# EAGLE design Lego PowerFunctions I2C Board (EAGLE 7.2.0)
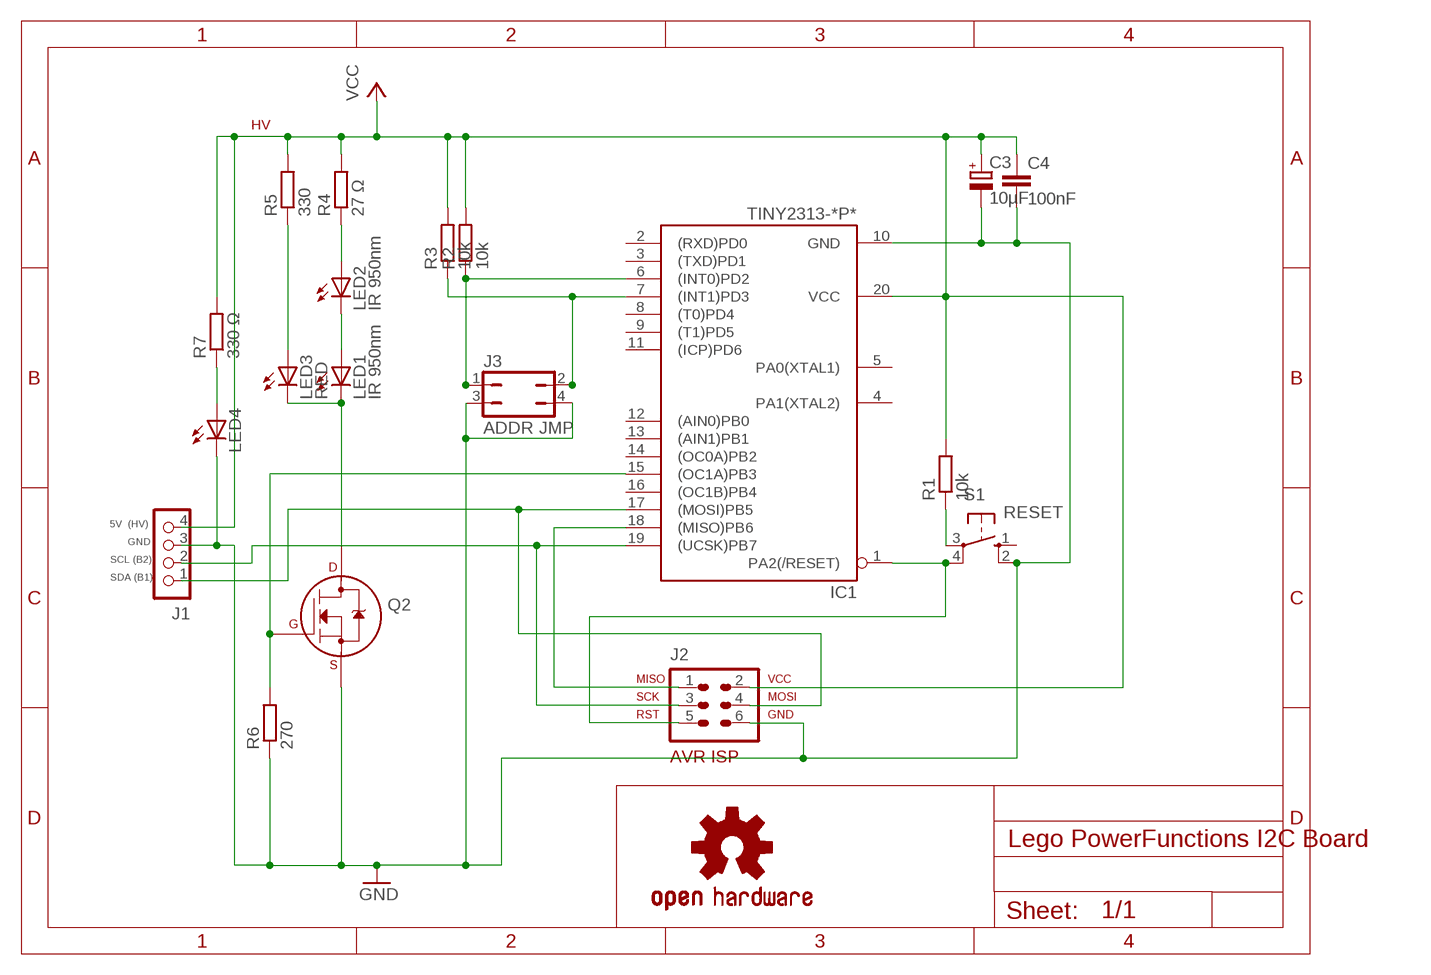
[diagram p0: schematic, sheet 1]

## Parts
C3  10µF  CPOL-EUE2.5-6  [E2,5-6]
C4  100nF  C-EU025-025X050  [C025-025X050]
IC1  TINY2313-*P*  [DIL20]
J1  CON_HEADER_1X04  [M1X4]
J2  AVR-ISP-6VERT  [AVR-ISP-6]
J3  ADDR JMP  JP2Q  [JP2Q]
LED1  IR 950nm  LED5MM  [LED5MM]
LED2  IR 950nm  LED5MM  [LED5MM]
LED3  RED  LED3MM  [LED3MM]
LED4  LED3MM  [LED3MM]
LOGO1  OSHW-LOGOM  [OSHW-LOGO-M]
Q2  2N7000_TO92  [TO-92]
R1  10k  R-EU_0207/10  [0207/10]
R2  10k  R-EU_0207/10  [0207/10]
R3  10k  R-EU_0207/10  [0207/10]
R4  27 Ω  R-EU_0207/10  [0207/10]
R5  330  R-EU_0207/10  [0207/10]
R6  270  R-EU_0207/10  [0207/10]
R7  330 Ω  R-EU_0207/10  [0207/10]
S1  RESET  10-XX  [B3F-10XX]

## Nets
GND: C3.- C4.2 IC1.10(GND) J1.3 J2.6 J3.3 J3.4 LED4.K(C) Q2.1(S) R6.1 S1.2(S1)
I2CADDRH: IC1.7((INT1)PD3) J3.2 R3.1
I2CADDRL: IC1.6((INT0)PD2) J3.1 R2.1
MISO: IC1.18((MISO)PB6) J2.1
MOSI: IC1.17((MOSI)PB5) J1.1 J2.4
N$2: LED4.A R7.1
N$9: R1.1 S1.3(P)
N$12: LED2.A R4.1
N$13: LED3.A R5.1
N$14: LED1.A LED2.K(C)
N$15: LED1.K(C) LED3.K(C) Q2.3(D)
N$17: IC1.15((OC1A)PB3) Q2.2(G) R6.2
RST: IC1.1(PA2(/RESET)) J2.5 S1.4(P1)
SCL: IC1.19((UCSK)PB7) J1.2 J2.3
VCC: C3.+ C4.1 IC1.20(VCC) J1.4 J2.2 R1.2 R2.2 R3.2 R4.2 R5.2 R7.2
Unconnected: IC1.2((RXD)PD0) IC1.3((TXD)PD1) IC1.4(PA1(XTAL2)) IC1.5(PA0(XTAL1)) IC1.8((T0)PD4) IC1.9((T1)PD5) IC1.11((ICP)PD6) IC1.12((AIN0)PB0) IC1.13((AIN1)PB1) IC1.14((OC0A)PB2) IC1.16((OC1B)PB4) S1.1(S)

## Notes on the sheet
- HV
- 5V  (HV)
- GND
- SCL (B2)
- SDA (B1)

## Library data of the parts
C3 = rcl:CPOL-EU: POLARIZED CAPACITOR, European symbol
C4 = rcl:C-EU: CAPACITOR, European symbol
IC1 = avr-7:TINY2313*: Atmel Tiny2313 2K Flash, 128 bytes EEPROM, 128 bytes RAM
J1 = dp_devices:CON_HEADER_1X04
J2 = avr-7:AVR-ISP-6: AVR ISP-6 Serial Programming Header
J3 = jumper:JP2Q: JUMPER
LED1-LED4 = led:LED: LED OSRAM: - CHIPLED LG R971, LG N971, LY N971, LG Q971, LY Q971, LO R971, LY R971 LH N974, LH R974 LS Q976, LO Q976, LY Q976 LO Q996 - Hyper CHIPLED LW Q18S LB Q993, LB Q99A, LB R99A - SideLED LS A670, LO A670, LY A670, LG A670, LP A670 LB A673, LV A673, LT A673, LW A673 LH A674 LY A675 LS A676, LA A676, LO A676, LY A676, LW A676 LS A679, LY A679, LG A679 - Hyper Micro SIDELED® LS Y876, LA Y876, LO Y876, LY Y876 LT Y87S - SmartLED LW L88C, LW L88S LB L89C, LB L89S, LG L890 LS L89K, LO L89K, LY L89K LS L896, LA L896, LO L896, LY L896 - TOPLED LS T670, LO T670, LY T670, LG T670, LP T670 LSG T670, LSP T670, LSY T670, LOP T670, LYG T670 LG T671, LOG T671, LSG T671 LB T673, LV T673, LT T673, LW T673 LH T674 LS T676, LA T676, LO T676, LY T676, LB T676, LH T676, LSB T676, LW T676 LB T67C, LV T67C, LT T67C, LS T67K, LO T67K, LY T67K, LW E67C LS E67B, LA E67B, LO E67B, LY E67B, LB E67C, LV E67C, LT E67C LW T67C LS T679, LY T679, LG T679 LS T770, LO T770, LY T770, LG T770, LP T770 LB T773, LV T773, LT T773, LW T773 LH T774 LS E675, LA E675, LY E675, LS T675 LS T776, LA T776, LO T776, LY T776, LB T776 LHGB T686 LT T68C, LB T68C - Hyper Mini TOPLED® LB M676 - Mini TOPLED Santana® LG M470 LS M47K, LO M47K, LY M47K Source: http://www.osram.convergy.de LUXEON: - LUMILED® LXK2-PW12-R00, LXK2-PW12-S00, LXK2-PW14-U00, LXK2-PW14-V00 LXK2-PM12-R00, LXK2-PM12-S00, LXK2-PM14-U00 LXK2-PE12-Q00, LXK2-PE12-R00, LXK2-PE12-S00, LXK2-PE14-T00, LXK2-PE14-U00 LXK2-PB12-K00, LXK2-PB12-L00, LXK2-PB12-M00, LXK2-PB14-N00, LXK2-PB14-P00, LXK2-PB14-Q00 LXK2-PR12-L00, LXK2-PR12-M00, LXK2-PR14-Q00, LXK2-PR14-R00 LXK2-PD12-Q00, LXK2-PD12-R00, LXK2-PD12-S00 LXK2-PH12-R00, LXK2-PH12-S00 LXK2-PL12-P00, LXK2-PL12-Q00, LXK2-PL12-R00 Source: www.luxeon.com KINGBRIGHT: KA-3528ASYC Source: www.kingbright.com
LOGO1 = SparkFun-Aesthetics:OSHW-LOGO: Open Source Hardware Logo This logo indicates the piece of hardware it is found on incorporates a OSHW license and/or adheres to the definition of open source hardware found here: http://freedomdefined.org/OSHW
Q2 = transistors:2N700*: 2N7000, 2N7002, NDS7002A N-channel enhancement mode MOSFET
R1-R7 = rcl:R-EU_: RESISTOR, European symbol
S1 = switch-omron:10-XX: OMRON SWITCH; MPN: B3F-1000; OC_FARNELL: 176432; OC_NEWARK: 36M3542

## Net classes
0 default: drill 0.61 mm

## Board
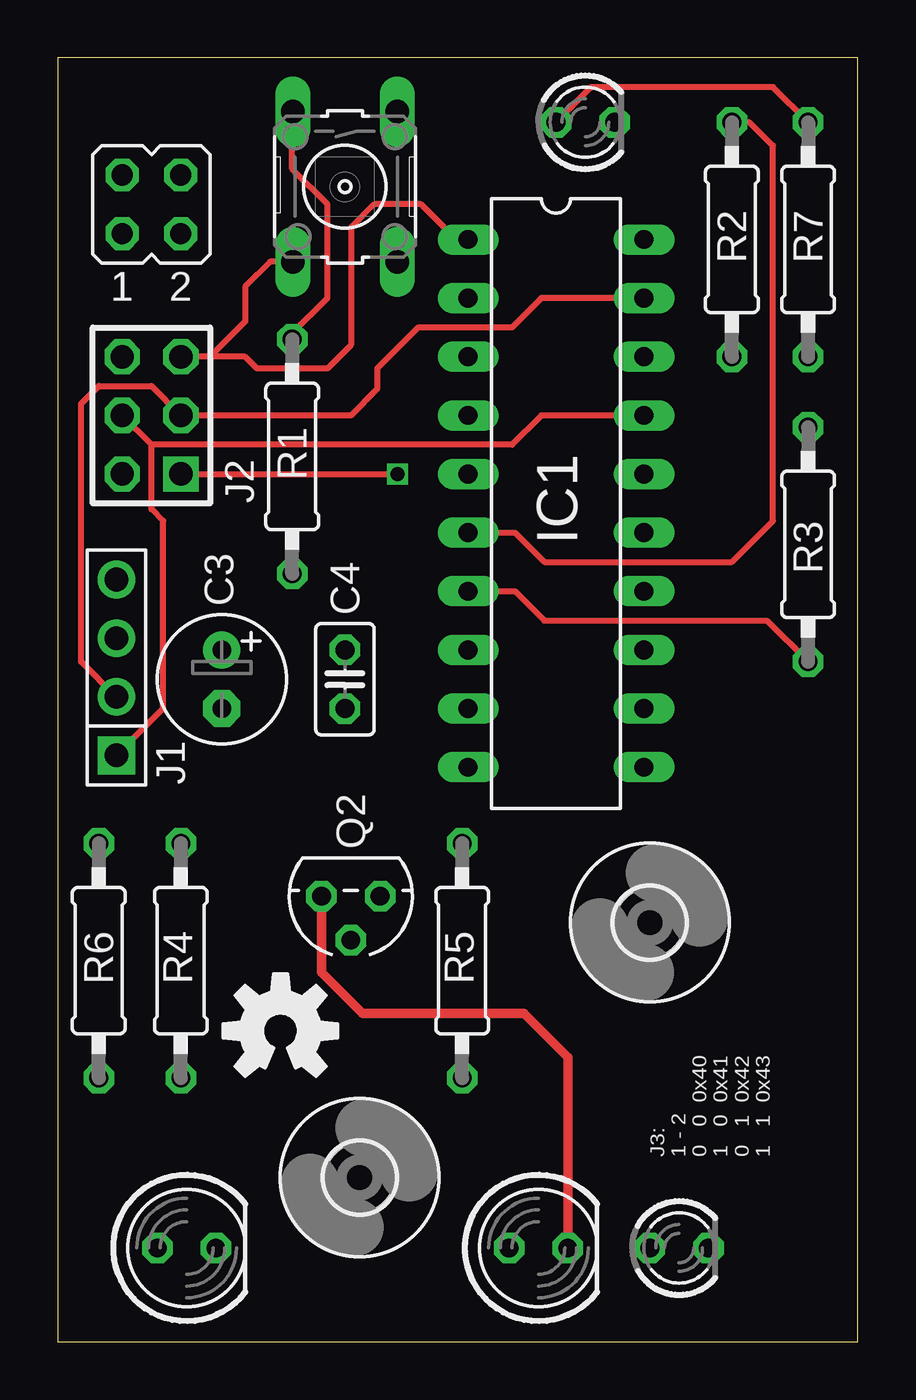
[diagram p1: board, top side]
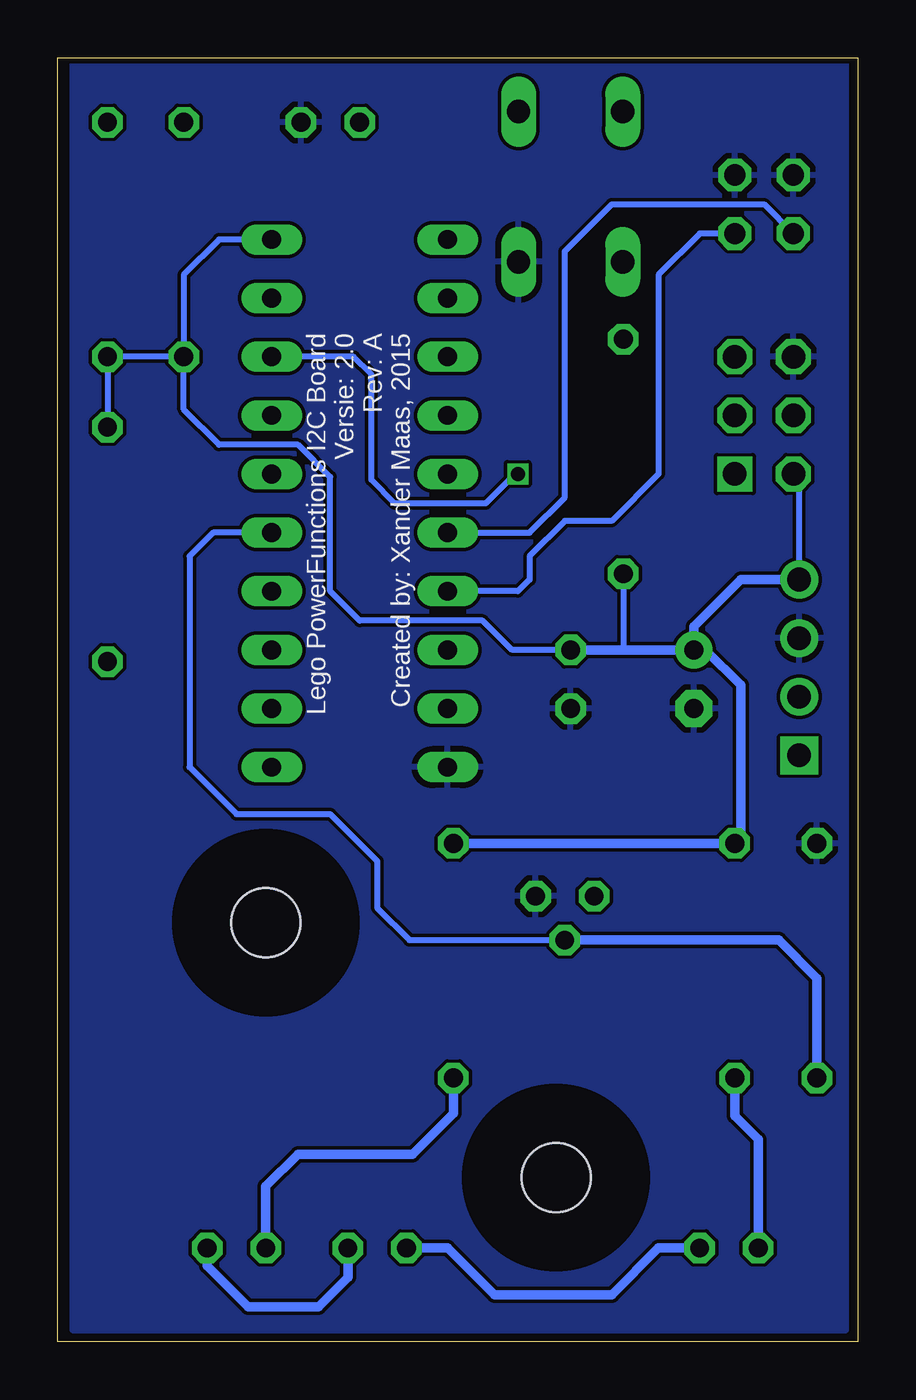
[diagram p2: board, bottom side, seen from below]

Size 34.67 x 55.63 mm. Coordinates in mm from the lower left corner, seen from the top.
Outline: 0,0 34.67,0 34.67,55.63 0,55.63 0,0
Copper layers (1*16): Top 0.035mm / dielectric 1.5mm / Bottom 0.035mm
Design rules "SeeedStudio_2layer_DRU_no_angle_20140221": minimum track width 6mil, minimum drill 12mil, track to track 6mil, track to pad 6mil, pad to pad 6mil, via to via 6mil, smd to smd 0mil, copper to edge 10mil, drill to drill 10mil, minimum pad ring 10mil, minimum via ring 6mil, stop-mask expansion 2mil, vias tented up to drill 100mil, thermal gap 10mil

### Footprints (pad centres in the part's own frame; a part is rotated, then mirrored left to right if it is on the bottom)
E2,5-6 = drill 0.813 pad 1.6: + -1.27,0 | drill 0.813 pad 1.6 octagon: - 1.27,0
C025-025X050 = drill 0.813 octagon: 1 -1.27,0; 2 1.27,0
DIL20 = drill 0.813 long: 1 -11.43,-3.81; 2 -8.89,-3.81; 3 -6.35,-3.81; 4 -3.81,-3.81; 5 -1.27,-3.81; 6 1.27,-3.81; 7 3.81,-3.81; 8 6.35,-3.81; 9 8.89,-3.81; 10 11.43,-3.81; 11 11.43,3.81; 12 8.89,3.81; 13 6.35,3.81; 14 3.81,3.81; 15 1.27,3.81; 16 -1.27,3.81; 17 -3.81,3.81; 18 -6.35,3.81; 19 -8.89,3.81; 20 -11.43,3.81
M1X4 = drill 1.02 pad 1.632 square: 1 0,0 | drill 1.02 pad 1.632: 2 2.54,0; 3 5.08,0; 4 7.62,0
AVR-ISP-6 = drill 1.016 square: 1 -2.54,-1.27 | drill 1.016 octagon: 2 -2.54,1.27; 3 0,-1.27; 4 0,1.27; 5 2.54,-1.27; 6 2.54,1.27
JP2Q = drill 0.914 octagon: 1 -1.27,-1.27; 2 1.27,-1.27; 3 -1.27,1.27; 4 1.27,1.27
LED5MM = drill 0.813 octagon: A -1.27,0; K 1.27,0
LED3MM = drill 0.813 octagon: A -1.27,0; K 1.27,0
TO-92 = drill 0.813 octagon: 1 -1.27,0; 2 0,1.905; 3 1.27,0
0207/10 = drill 0.813 octagon: 1 -5.08,0; 2 5.08,0
B3F-10XX = drill 1.016 long: 1 -3.251,2.261; 2 3.251,2.261; 3 -3.251,-2.261; 4 3.251,-2.261
3,0 = hole 3: 0,0

### Placement (x,y rotation side)
C3  7.11,28.7 270 top
C4  12.45,28.7 270 top
IC1  21.59,36.32 270 top
J1  2.54,25.4 90 top
J2  4.06,40.13 90 top
J3  4.06,49.28 0 top
LED1  20.83,4.06 0 top
LED2  5.59,4.06 0 top
LED3  26.92,4.06 0 top
LED4  22.86,52.83 0 top
LOGO1  9.65,13.46 0 top
Q2  12.7,19.3 180 top
R1  10.16,38.35 270 top
R2  29.21,47.75 270 top
R3  32.51,34.54 90 top
R4  5.33,16.51 90 top
R5  17.53,16.51 90 top
R6  1.78,16.51 270 top
R7  32.51,47.75 270 top
S1  12.45,50.04 270 top
U$1  [3,0]  13.08,7.11 0 top
U$2  [3,0]  25.65,18.16 0 top

### Tracks (layer width: path | path; a pad name or v marks a point on that pad's centre or on a via)
GND
  pour Bottom: 0.51,55.37 34.04,55.37 34.04,0.51 0.51,0.51
I2CADDRH
  Top 0.254: IC1.7 19.81,32.51 21.08,31.24 30.73,31.24 R3.1
  Bottom 0.254: J3.2 6.86,48.01 8.64,46.23 8.64,37.59 10.67,35.56 12.7,35.56 14.22,34.04 14.22,33.02 14.73,32.51 IC1.7
I2CADDRL
  Top 0.254: IC1.6 19.81,35.05 21.08,33.78 29.21,33.78 30.99,35.56 30.99,51.82 29.97,52.83 R2.1
  Bottom 0.254: IC1.6 14.22,35.05 12.7,36.58 12.7,47.24 10.67,49.28 4.06,49.28 J3.1
MISO  (via drill 0.61)
  Top 0.254: J2.1 v14.73,37.59
  Bottom 0.254: v14.73,37.59 14.86,37.59 16.13,36.32 20.07,36.32 21.08,37.34 21.08,41.91 21.84,42.67 IC1.18
MOSI
  Top 0.254: IC1.17 20.95,40.13 19.68,38.86 4.06,38.86 | 4.06,38.86 J2.4 | J1.1 4.57,27.43 4.57,35.56 4.06,36.07 4.06,38.86
N$2
  Top 0.254: R7.1 30.99,54.36 23.11,54.36 LED4.A
N$9
  Top 0.254: R1.1 10.16,43.69 11.68,45.21 11.68,49.28 10.16,50.8 10.16,53.26
  Top 0.305: 10.16,53.26 S1.3
N$12
  Bottom 0.406: LED2.A 4.32,8.76 5.33,9.78 R4.1
N$13
  Bottom 0.406: R5.1 17.53,9.91 19.3,8.13 24.26,8.13 25.65,6.73 LED3.A
N$14
  Bottom 0.406: LED1.A 17.78,4.06 15.75,2.03 10.67,2.03 8.64,4.06 LED2.K
N$15
  Top 0.406: Q2.3 11.43,16 13.21,14.22 20.19,14.22 22.1,12.32 LED1.K
  Bottom 0.406: LED3.K 28.19,3.3 26.42,1.52 23.37,1.52 22.1,2.79 LED1.K
N$17
  Bottom 0.254: IC1.15 27.94,35.05 28.96,34.04 28.96,24.89 26.92,22.86 22.86,22.86 20.83,20.83 20.83,18.8 19.43,17.4 Q2.2
  Bottom 0.406: Q2.2 3.43,17.4 1.78,15.75 R6.2
RST
  Top 0.254: IC1.1 17.27,47.75 15.75,49.28 13.72,49.28 12.7,48.26 12.7,43.18 11.68,42.16 8.64,42.16 8.13,42.67 6.6,42.67 | 6.6,42.67 J2.5 | S1.4 9.2,46.79 8.13,45.72 8.13,44.2 6.6,42.67
SCL
  Top 0.254: IC1.19 20.95,45.21 19.68,43.94 15.62,43.94 13.84,42.16 13.84,41.27 12.7,40.13 J2.3 4.06,41.4 1.78,41.4 1.02,40.64 1.02,29.46 J1.2
VCC
  Bottom 0.254: IC1.20 27.69,47.75 29.21,46.23 R2.2 | R2.2 R7.2 R3.2 | J1.4 2.54,37.34 J2.2 | C4.1 14.99,29.97 16.26,31.24 21.59,31.24 22.86,32.51 22.86,37.47 24.26,38.86 27.69,38.86 29.21,40.39 R2.2 | R1.2 10.16,29.97
  Bottom 0.406: R5.2 R4.2 5.08,21.84 5.08,28.45 6.6,29.97 C3.+ | J1.4 5.08,33.02 7.11,30.99 C3.+ | C3.+ 10.16,29.97 C4.1

### Text on the board
tNames: J3: / 1 - 2 / 0 0 0x40 / 1 0 0x41 / 0 1 0x42 / 1 1 0x43
bNames: Lego PowerFunctions I2C Board / Versie: 2.0 / Rev: A / Created by: Xander Maas, 2015